# EAGLE design Dev-PCB (EAGLE 6.6.0)

## Sheet 1 of 2
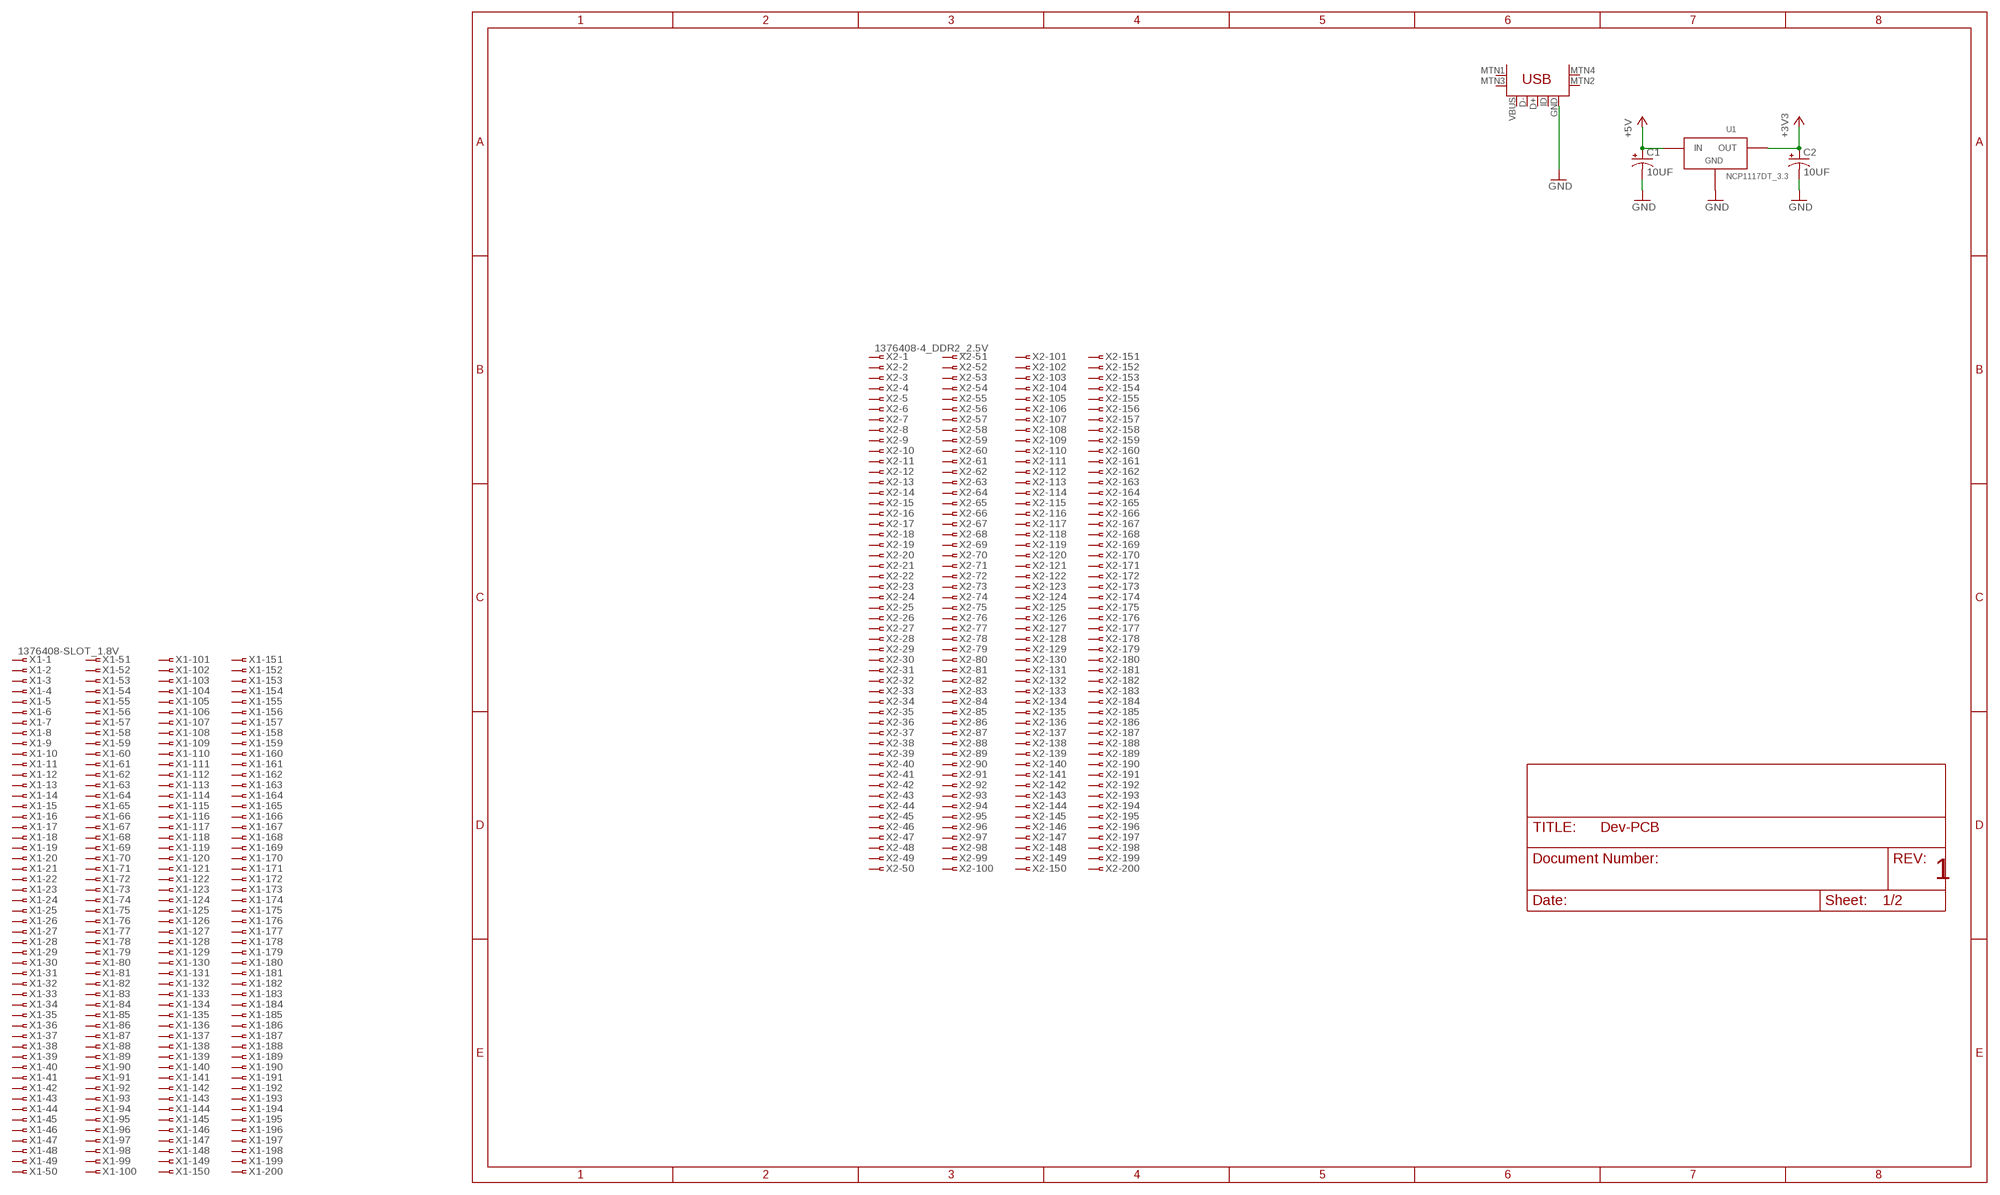
[diagram p0: schematic, sheet 1]

### Parts
C1  10UF  CAP-POL_10UF_16V  [EIA3216-16V]
C2  10UF  CAP-POL_10UF_16V  [EIA3216-16V]
U1  NCP1117DT_3.3  [DPAK]
U$1  USB-MINIB-5PIN  [USB-MINIB]
X1  1376408-SLOT_1.8V  [SLOT-1376408-1_1.8V]
X2  1376408-4_DDR2_2.5V  [1-1376408-4]

### Nets
+3V3: C2.A(+) U1.2(OUT)
+5V: C1.A(+) U1.3(IN)
GND: C1.C(+1) C2.C(+1) U1.1(GND) U$1.GND
Unconnected: U$1.D+ U$1.D- U$1.ID U$1.MTN1(MTN2) U$1.MTN2(MTN3) U$1.MTN3(MTN1) U$1.MTN4 U$1.VBUS X1.1 X1.2 X1.3 X1.4 X1.5 X1.6 X1.7 X1.8 X1.9 X1.10 X1.11 X1.12 X1.13 X1.14 X1.15 X1.16 X1.17 X1.18 X1.19 X1.20 X1.21 X1.22 X1.23 X1.24 X1.25 X1.26 X1.27 X1.28 X1.29 X1.30 X1.31 X1.32 X1.33 X1.34 X1.35 X1.36 X1.37 X1.38 X1.39 X1.40 X1.41 X1.42 X1.43 X1.44 X1.45 X1.46 X1.47 X1.48 X1.49 X1.50 X1.51 X1.52 X1.53 X1.54 X1.55 X1.56 X1.57 X1.58 X1.59 X1.60 X1.61 X1.62 X1.63 X1.64 X1.65 X1.66 X1.67 X1.68 X1.69 X1.70 X1.71 X1.72 X1.73 X1.74 X1.75 X1.76 X1.77 X1.78 X1.79 X1.80 X1.81 X1.82 X1.83 X1.84 X1.85 X1.86 X1.87 X1.88 X1.89 X1.90 X1.91 X1.92 X1.93 X1.94 X1.95 X1.96 X1.97 X1.98 X1.99 X1.100 X1.101 X1.102 X1.103 X1.104 X1.105 X1.106 X1.107 X1.108 X1.109 X1.110 X1.111 X1.112 X1.113 X1.114 X1.115 X1.116 X1.117 X1.118 X1.119 X1.120 X1.121 X1.122 X1.123 X1.124 X1.125 X1.126 X1.127 X1.128 X1.129 X1.130 X1.131 X1.132 X1.133 X1.134 X1.135 X1.136 X1.137 X1.138 X1.139 X1.140 X1.141 X1.142 X1.143 X1.144 X1.145 X1.146 X1.147 X1.148 X1.149 X1.150 X1.151 X1.152 X1.153 X1.154 X1.155 X1.156 X1.157 X1.158 X1.159 X1.160 X1.161 X1.162 X1.163 X1.164 X1.165 X1.166 X1.167 X1.168 X1.169 X1.170 X1.171 X1.172 X1.173 X1.174 X1.175 X1.176 X1.177 X1.178 X1.179 X1.180 X1.181 X1.182 X1.183 X1.184 X1.185 X1.186 X1.187 X1.188 X1.189 X1.190 X1.191 X1.192 X1.193 X1.194 X1.195 X1.196 X1.197 X1.198 X1.199 X1.200 X2.1 X2.2 X2.3 X2.4 X2.5 X2.6 X2.7 X2.8 X2.9 X2.10 X2.11 X2.12 X2.13 X2.14 X2.15 X2.16 X2.17 X2.18 X2.19 X2.20 X2.21 X2.22 X2.23 X2.24 X2.25 X2.26 X2.27 X2.28 X2.29 X2.30 X2.31 X2.32 X2.33 X2.34 X2.35 X2.36 X2.37 X2.38 X2.39 X2.40 X2.41 X2.42 X2.43 X2.44 X2.45 X2.46 X2.47 X2.48 X2.49 X2.50 X2.51 X2.52 X2.53 X2.54 X2.55 X2.56 X2.57 X2.58 X2.59 X2.60 X2.61 X2.62 X2.63 X2.64 X2.65 X2.66 X2.67 X2.68 X2.69 X2.70 X2.71 X2.72 X2.73 X2.74 X2.75 X2.76 X2.77 X2.78 X2.79 X2.80 X2.81 X2.82 X2.83 X2.84 X2.85 X2.86 X2.87 X2.88 X2.89 X2.90 X2.91 X2.92 X2.93 X2.94 X2.95 X2.96 X2.97 X2.98 X2.99 X2.100 X2.101 X2.102 X2.103 X2.104 X2.105 X2.106 X2.107 X2.108 X2.109 X2.110 X2.111 X2.112 X2.113 X2.114 X2.115 X2.116 X2.117 X2.118 X2.119 X2.120 X2.121 X2.122 X2.123 X2.124 X2.125 X2.126 X2.127 X2.128 X2.129 X2.130 X2.131 X2.132 X2.133 X2.134 X2.135 X2.136 X2.137 X2.138 X2.139 X2.140 X2.141 X2.142 X2.143 X2.144 X2.145 X2.146 X2.147 X2.148 X2.149 X2.150 X2.151 X2.152 X2.153 X2.154 X2.155 X2.156 X2.157 X2.158 X2.159 X2.160 X2.161 X2.162 X2.163 X2.164 X2.165 X2.166 X2.167 X2.168 X2.169 X2.170 X2.171 X2.172 X2.173 X2.174 X2.175 X2.176 X2.177 X2.178 X2.179 X2.180 X2.181 X2.182 X2.183 X2.184 X2.185 X2.186 X2.187 X2.188 X2.189 X2.190 X2.191 X2.192 X2.193 X2.194 X2.195 X2.196 X2.197 X2.198 X2.199 X2.200

### Notes on the sheet
- 1

## Sheet 2 of 2

## Library data of the parts
C1 C2 = FSAE Eletric:CAP-POL; PARTNO: T491A106M016AT
U1 = FSAE Eletric:NCP1117DT; PARTNO: NCP1117DT33RKG
U$1 = SparkFun-Connectors:USB-MINIB: Mini-USB "B" connector with 5th pin broken out. Created new symbol breaking out 5th "ID" pin in mini/micro USB connector spec. See: http://en.wikipedia.org/wiki/Mini_usb#Cables. Uses same footprint as 4-pin symbol. Also added pins to connect to mounting / shield pads if required (probably not generally needed as signals aren't shielded once they leave the connector).
X1 X2 = con-amp:1376408: DDR1 & DDR2 SODIMM SOCKET 0.6mm Pitch 200 Pos. Standard Profile, Standard Type (used on Kontron X-Board) Source: http://catalog.tycoelectronics.com .. JPN_CD_1376408_S.pdf

## Board
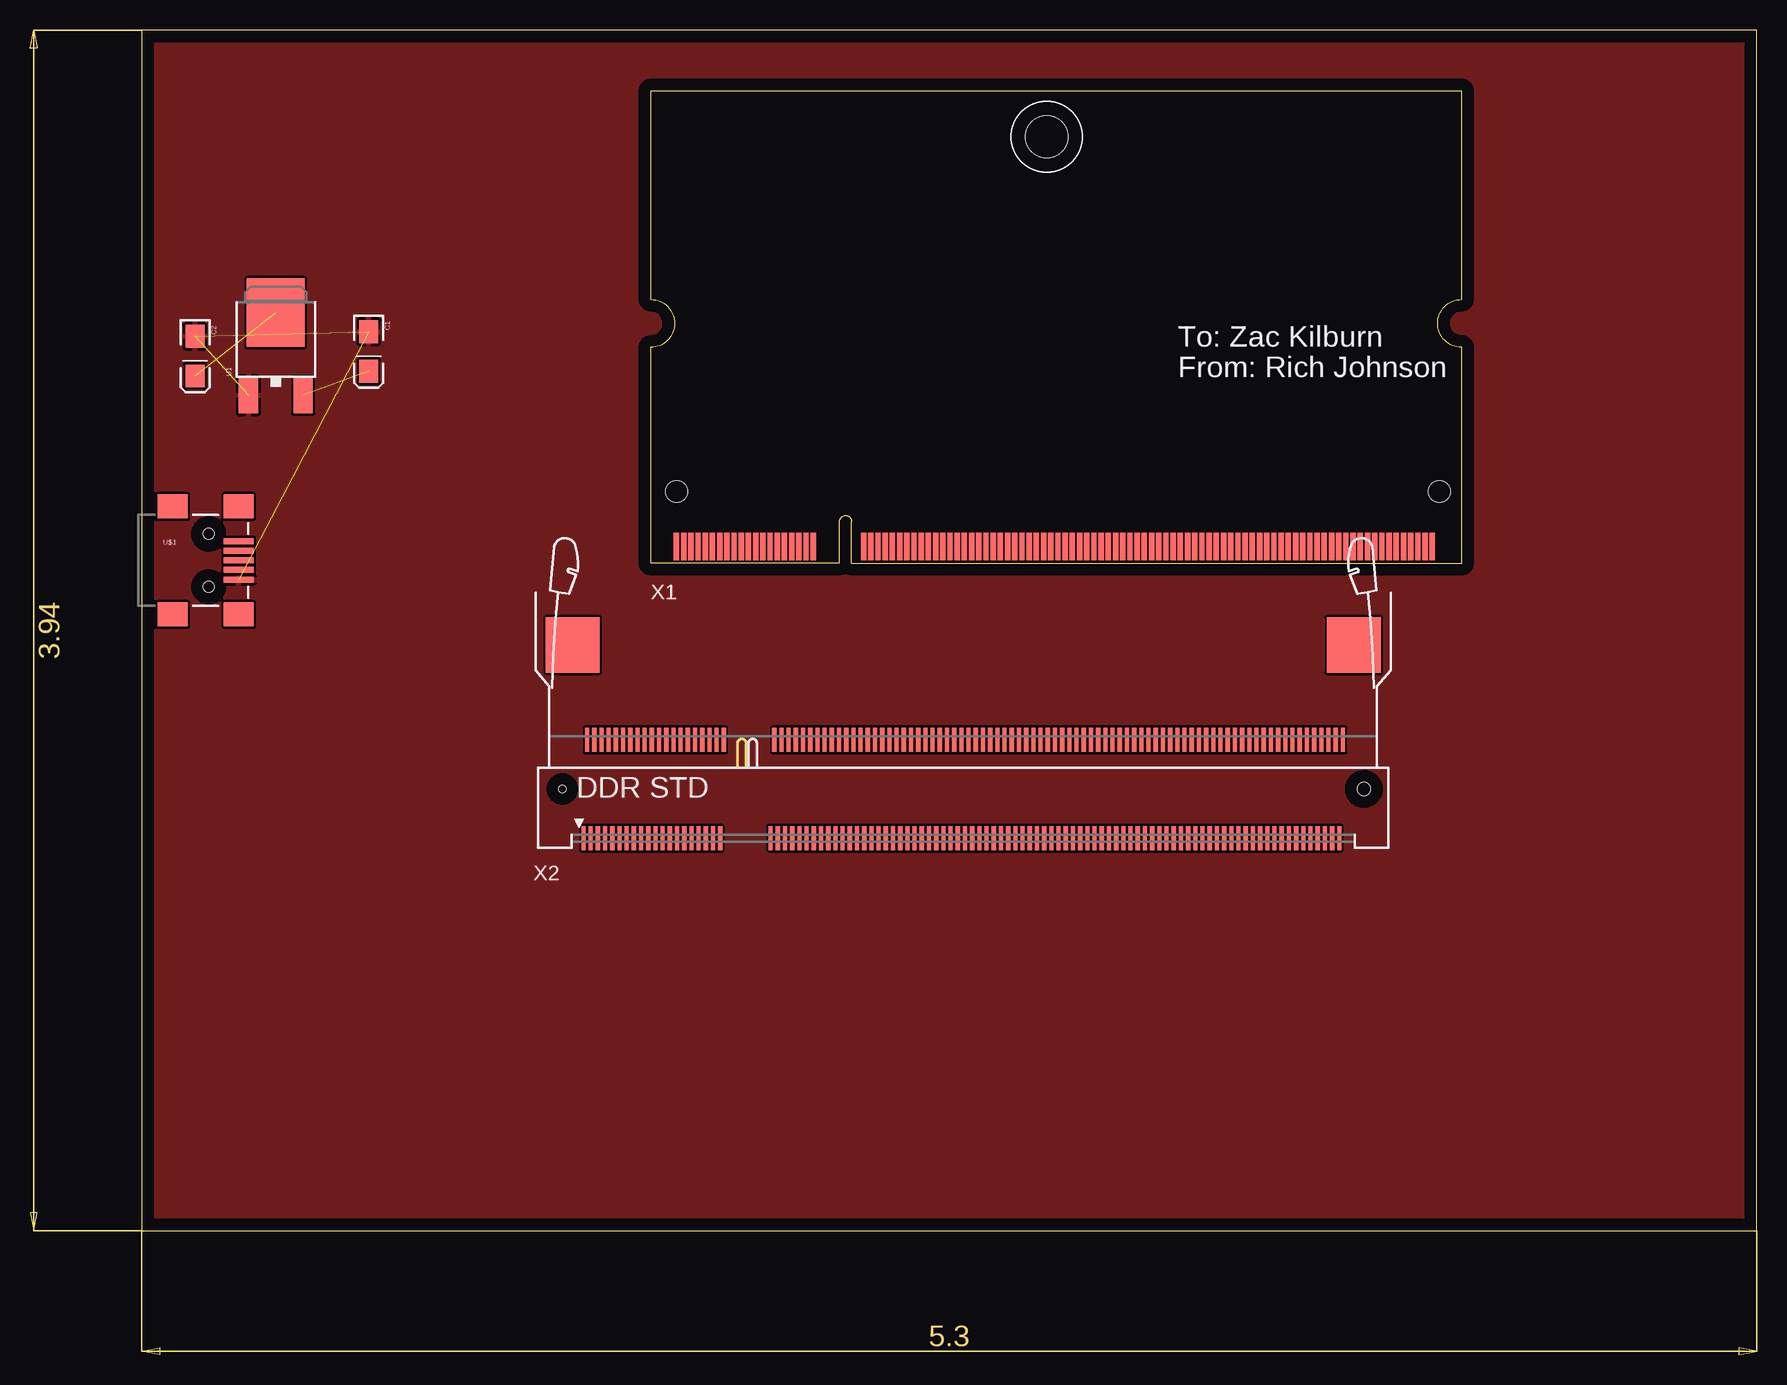
[diagram p1: board, top side]
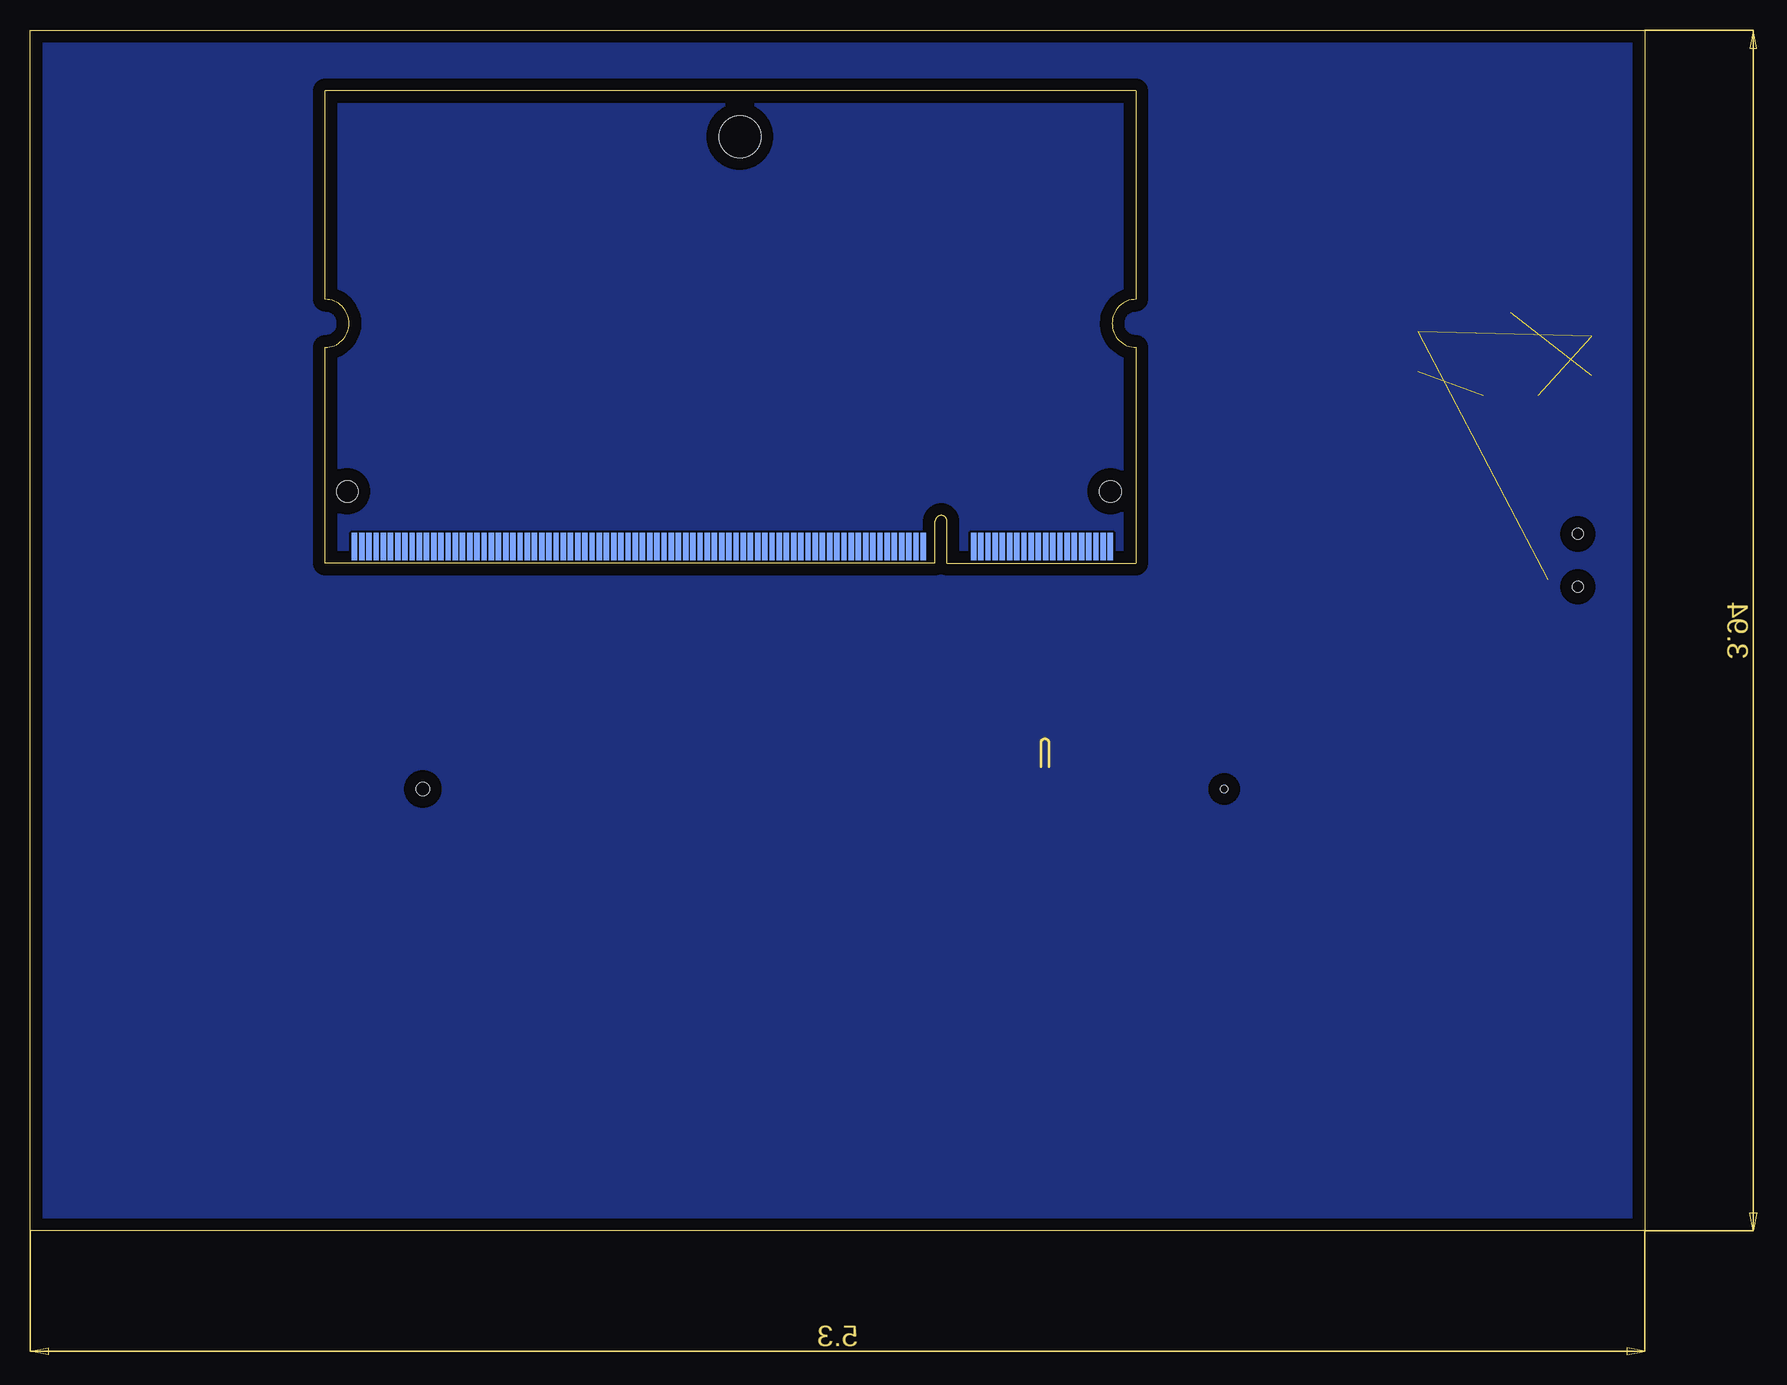
[diagram p2: board, bottom side, seen from below]

Size 134.62 x 100.08 mm. Coordinates in mm from the lower left corner, seen from the top.
Outline: 0,0 134.62,0 134.62,100.08 0,100.08 0,0
Copper layers (1*16): Top 0.035mm / dielectric 1.5mm / Bottom 0.035mm
Design rules "default": minimum track width 10mil, minimum drill 24mil, track to track 8mil, track to pad 8mil, pad to pad 8mil, via to via 8mil, smd to smd 8mil, copper to edge 40mil, drill to drill 8mil, minimum pad ring 10mil, minimum via ring 8mil, stop-mask expansion 4mil, vias tented up to drill 0mil, thermal gap 10mil

### Footprints (pad centres in the part's own frame; a part is rotated, then mirrored left to right if it is on the bottom)
EIA3216-16V = smd 1.9 x 1.6: A 1.65,0; C -1.65,0
DPAK = smd 1.6 x 3: 1 -2.28,-4.04; 3 2.28,-4.04 | smd 4.826 x 5.715: 2 0,2.858
USB-MINIB = smd 2.5 x 0.5: D+ 2.5,0; D- 2.5,0.8; GND 2.5,-1.6; ID 2.5,-0.8; VBUS 2.5,1.6 | smd 2.5 x 2: MTN1 -3,4.5; MTN2 2.5,4.5; MTN3 -3,-4.5; MTN4 2.5,-4.5 | hole 0.9: 0,2.2; 0,-2.2
SLOT-1376408-1_1.8V = smd 0.45 x 2.3: 1 2.15,1.4; 3 2.75,1.4; 5 3.35,1.4; 7 3.95,1.4; 9 4.55,1.4; 11 5.15,1.4; 13 5.75,1.4; 15 6.35,1.4; 17 6.95,1.4; 19 7.55,1.4; 21 8.15,1.4; 23 8.75,1.4; 25 9.35,1.4; 27 9.95,1.4; 29 10.55,1.4; 31 11.15,1.4; 33 11.75,1.4; 35 12.35,1.4; 37 12.95,1.4; 39 13.55,1.4; 41 17.75,1.4; 43 18.35,1.4; 45 18.95,1.4; 47 19.55,1.4; 49 20.15,1.4; 51 20.75,1.4; 53 21.35,1.4; 55 21.95,1.4; 57 22.55,1.4; 59 23.15,1.4; 61 23.75,1.4; 63 24.35,1.4; 65 24.95,1.4; 67 25.55,1.4; 69 26.15,1.4; 71 26.75,1.4; 73 27.35,1.4; 75 27.95,1.4; 77 28.55,1.4; 79 29.15,1.4; 81 29.75,1.4; 83 30.35,1.4; 85 30.95,1.4; 87 31.55,1.4; 89 32.15,1.4; 91 32.75,1.4; 93 33.35,1.4; 95 33.95,1.4; 97 34.55,1.4; 99 35.15,1.4; 101 35.75,1.4; 103 36.35,1.4; 105 36.95,1.4; 107 37.55,1.4; 109 38.15,1.4; 111 38.75,1.4; 113 39.35,1.4; 115 39.95,1.4; 117 40.55,1.4; 119 41.15,1.4; 121 41.75,1.4; 123 42.35,1.4; 125 42.95,1.4; 127 43.55,1.4; 129 44.15,1.4; 131 44.75,1.4; 133 45.35,1.4; 135 45.95,1.4; 137 46.55,1.4; 139 47.15,1.4; 141 47.75,1.4; 143 48.35,1.4; 145 48.95,1.4; 147 49.55,1.4; 149 50.15,1.4; 151 50.75,1.4; 153 51.35,1.4; 155 51.95,1.4; 157 52.55,1.4; 159 53.15,1.4; 161 53.75,1.4; 163 54.35,1.4; 165 54.95,1.4; 167 55.55,1.4; 169 56.15,1.4; 171 56.75,1.4; 173 57.35,1.4; 175 57.95,1.4; 177 58.55,1.4; 179 59.15,1.4; 181 59.75,1.4; 183 60.35,1.4; 185 60.95,1.4; 187 61.55,1.4; 189 62.15,1.4; 191 62.75,1.4; 193 63.35,1.4; 195 63.95,1.4; 197 64.55,1.4; 199 65.15,1.4 | smd 0.45 x 2.3 bottom: 2 2.15,1.4; 4 2.75,1.4; 6 3.35,1.4; 8 3.95,1.4; 10 4.55,1.4; 12 5.15,1.4; 14 5.75,1.4; 16 6.35,1.4; 18 6.95,1.4; 20 7.55,1.4; 22 8.15,1.4; 24 8.75,1.4; 26 9.35,1.4; 28 9.95,1.4; 30 10.55,1.4; 32 11.15,1.4; 34 11.75,1.4; 36 12.35,1.4; 38 12.95,1.4; 40 13.55,1.4; 42 17.75,1.4; 44 18.35,1.4; 46 18.95,1.4; 48 19.55,1.4; 50 20.15,1.4; 52 20.75,1.4; 54 21.35,1.4; 56 21.95,1.4; 58 22.55,1.4; 60 23.15,1.4; 62 23.75,1.4; 64 24.35,1.4; 66 24.95,1.4; 68 25.55,1.4; 70 26.15,1.4; 72 26.75,1.4; 74 27.35,1.4; 76 27.95,1.4; 78 28.55,1.4; 80 29.15,1.4; 82 29.75,1.4; 84 30.35,1.4; 86 30.95,1.4; 88 31.55,1.4; 90 32.15,1.4; 92 32.75,1.4; 94 33.35,1.4; 96 33.95,1.4; 98 34.55,1.4; 100 35.15,1.4; 102 35.75,1.4; 104 36.35,1.4; 106 36.95,1.4; 108 37.55,1.4; 110 38.15,1.4; 112 38.75,1.4; 114 39.35,1.4; 116 39.95,1.4; 118 40.55,1.4; 120 41.15,1.4; 122 41.75,1.4; 124 42.35,1.4; 126 42.95,1.4; 128 43.55,1.4; 130 44.15,1.4; 132 44.75,1.4; 134 45.35,1.4; 136 45.95,1.4; 138 46.55,1.4; 140 47.15,1.4; 142 47.75,1.4; 144 48.35,1.4; 146 48.95,1.4; 148 49.55,1.4; 150 50.15,1.4; 152 50.75,1.4; 154 51.35,1.4; 156 51.95,1.4; 158 52.55,1.4; 160 53.15,1.4; 162 53.75,1.4; 164 54.35,1.4; 166 54.95,1.4; 168 55.55,1.4; 170 56.15,1.4; 172 56.75,1.4; 174 57.35,1.4; 176 57.95,1.4; 178 58.55,1.4; 180 59.15,1.4; 182 59.75,1.4; 184 60.35,1.4; 186 60.95,1.4; 188 61.55,1.4; 190 62.15,1.4; 192 62.75,1.4; 194 63.35,1.4; 196 63.95,1.4; 198 64.55,1.4; 200 65.15,1.4 | hole 1.8: 2.15,6; 65.75,6 | hole 3.5: 33.02,35.56
1-1376408-4 = smd 0.35 x 2: 1 -32.65,-4.1; 2 -32.35,4.1; 3 -32.05,-4.1; 4 -31.75,4.1; 5 -31.45,-4.1; 6 -31.15,4.1; 7 -30.85,-4.1; 8 -30.55,4.1; 9 -30.25,-4.1; 10 -29.95,4.1; 11 -29.65,-4.1; 12 -29.35,4.1; 13 -29.05,-4.1; 14 -28.75,4.1; 15 -28.45,-4.1; 16 -28.15,4.1; 17 -27.85,-4.1; 18 -27.55,4.1; 19 -27.25,-4.1; 20 -26.95,4.1; 21 -26.65,-4.1; 22 -26.35,4.1; 23 -26.05,-4.1; 24 -25.75,4.1; 25 -25.45,-4.1; 26 -25.15,4.1; 27 -24.85,-4.1; 28 -24.55,4.1; 29 -24.25,-4.1; 30 -23.95,4.1; 31 -23.65,-4.1; 32 -23.35,4.1; 33 -23.05,-4.1; 34 -22.75,4.1; 35 -22.45,-4.1; 36 -22.15,4.1; 37 -21.85,-4.1; 38 -21.55,4.1; 39 -21.25,-4.1; 40 -20.95,4.1; 41 -17.05,-4.1; 42 -16.75,4.1; 43 -16.45,-4.1; 44 -16.15,4.1; 45 -15.85,-4.1; 46 -15.55,4.1; 47 -15.25,-4.1; 48 -14.95,4.1; 49 -14.65,-4.1; 50 -14.35,4.1; 51 -14.05,-4.1; 52 -13.75,4.1; 53 -13.45,-4.1; 54 -13.15,4.1; 55 -12.85,-4.1; 56 -12.55,4.1; 57 -12.25,-4.1; 58 -11.95,4.1; 59 -11.65,-4.1; 60 -11.35,4.1; 61 -11.05,-4.1; 62 -10.75,4.1; 63 -10.45,-4.1; 64 -10.15,4.1; 65 -9.85,-4.1; 66 -9.55,4.1; 67 -9.25,-4.1; 68 -8.95,4.1; 69 -8.65,-4.1; 70 -8.35,4.1; 71 -8.05,-4.1; 72 -7.75,4.1; 73 -7.45,-4.1; 74 -7.15,4.1; 75 -6.85,-4.1; 76 -6.55,4.1; 77 -6.25,-4.1; 78 -5.95,4.1; 79 -5.65,-4.1; 80 -5.35,4.1; 81 -5.05,-4.1; 82 -4.75,4.1; 83 -4.45,-4.1; 84 -4.15,4.1; 85 -3.85,-4.1; 86 -3.55,4.1; 87 -3.25,-4.1; 88 -2.95,4.1; 89 -2.65,-4.1; 90 -2.35,4.1; 91 -2.05,-4.1; 92 -1.75,4.1; 93 -1.45,-4.1; 94 -1.15,4.1; 95 -0.85,-4.1; 96 -0.55,4.1; 97 -0.25,-4.1; 98 0.05,4.1; 99 0.35,-4.1; 100 0.65,4.1; 101 0.95,-4.1; 102 1.25,4.1; 103 1.55,-4.1; 104 1.85,4.1; 105 2.15,-4.1; 106 2.45,4.1; 107 2.75,-4.1; 108 3.05,4.1; 109 3.35,-4.1; 110 3.65,4.1; 111 3.95,-4.1; 112 4.25,4.1; 113 4.55,-4.1; 114 4.85,4.1; 115 5.15,-4.1; 116 5.45,4.1; 117 5.75,-4.1; 118 6.05,4.1; 119 6.35,-4.1; 120 6.65,4.1; 121 6.95,-4.1; 122 7.25,4.1; 123 7.55,-4.1; 124 7.85,4.1; 125 8.15,-4.1; 126 8.45,4.1; 127 8.75,-4.1; 128 9.05,4.1; 129 9.35,-4.1; 130 9.65,4.1; 131 9.95,-4.1; 132 10.25,4.1; 133 10.55,-4.1; 134 10.85,4.1; 135 11.15,-4.1; 136 11.45,4.1; 137 11.75,-4.1; 138 12.05,4.1; 139 12.35,-4.1; 140 12.65,4.1; 141 12.95,-4.1; 142 13.25,4.1; 143 13.55,-4.1; 144 13.85,4.1; 145 14.15,-4.1; 146 14.45,4.1; 147 14.75,-4.1; 148 15.05,4.1; 149 15.35,-4.1; 150 15.65,4.1; 151 15.95,-4.1; 152 16.25,4.1; 153 16.55,-4.1; 154 16.85,4.1; 155 17.15,-4.1; 156 17.45,4.1; 157 17.75,-4.1; 158 18.05,4.1; 159 18.35,-4.1; 160 18.65,4.1; 161 18.95,-4.1; 162 19.25,4.1; 163 19.55,-4.1; 164 19.85,4.1; 165 20.15,-4.1; 166 20.45,4.1; 167 20.75,-4.1; 168 21.05,4.1; 169 21.35,-4.1; 170 21.65,4.1; 171 21.95,-4.1; 172 22.25,4.1; 173 22.55,-4.1; 174 22.85,4.1; 175 23.15,-4.1; 176 23.45,4.1; 177 23.75,-4.1; 178 24.05,4.1; 179 24.35,-4.1; 180 24.65,4.1; 181 24.95,-4.1; 182 25.25,4.1; 183 25.55,-4.1; 184 25.85,4.1; 185 26.15,-4.1; 186 26.45,4.1; 187 26.75,-4.1; 188 27.05,4.1; 189 27.35,-4.1; 190 27.65,4.1; 191 27.95,-4.1; 192 28.25,4.1; 193 28.55,-4.1; 194 28.85,4.1; 195 29.15,-4.1; 196 29.45,4.1; 197 29.75,-4.1; 198 30.05,4.1; 199 30.35,-4.1; 200 30.65,4.1 | smd 4.5 x 4.6: M1 -33.55,12; M2 31.55,12 | hole 0.6: -34.4,0 | hole 1.1: 32.4,0

### Placement (x,y rotation side)
C1  18.92,73.28 270 top
C2  4.45,72.9 270 top
U1  11.18,73.66 0 top
U$1  5.59,55.88 0 top
X1  42.42,55.63 0 top
X2  69.47,36.83 0 top

### Tracks (layer width: path | path; a pad name or v marks a point on that pad's centre or on a via)
+3V3  (1 unrouted)
+5V  (1 unrouted)
GND  (3 unrouted)
  pour Top: 0,100.08 134.62,100.08 134.62,0 0,0
  pour Bottom: 0,100.08 134.62,100.08 134.62,0 0,0

### Text on the board
tPlace: To: Zac Kilburn | From: Rich Johnson